# Altium project QUANTUM_PCI_v1.PrjPcb (part 3 of 3)

## Sheet 09-USBUart_PPSMUX_UARTMUX.SchDoc
size B; SPICEModelCacheLIOYUQKN: <root> / <DocumentId>LIOYUQKN</DocumentId> / <CacheFrame Number="0"> / <Model Name="emk105bj105_v-f" Kind="CKT"> / <Text>* EMK105BJ105_V-F     SPICE MODEL  ( General Type ) / *-------------------------------------------------------------------------------------------------------- / * Model Generated by TAIYO YUDEN Corporation (http://www.ty-top.com) / * Version 1.0 / * TAIYO YUDEN Control No. 170508_130520 / * Copyright(c) 2012 TAIYO YUDEN CO.,LTD. All Rights Reserved. / *-------------------------------------------------------------------------------------------------------- / * / * Products Name : Multilayer Ceramic Capacitors / * / * Characteristics : / *     Capacitance : 1 uF , Rated Voltage : 16V , TCC : X5R / *     Case Size : 1.0 x 0.5 / 0.039 x 0.02 [mm/inch] , Thickness : 0.5 / 0.02 [mm/inch] / *     (Conditions: Temperature = 25 degC , DC Bias Current/Voltage = 0A / 0V) / * / * Frequency Range : 40Hz - 3GHz / * / * External Node Assignments : / * / *  1  o---| |---o  2 / * / *-------------------------------------------------------------------------------------------------------- / .SubCkt EMK105BJ105_V-F 1 2 / **************************** / C0 1 110 0.68309u / Cm 1 101 0.26053u / C1 101 102 0.94076u / Rc1 101 102 1.9029k / C2 102 103 0.66707u / Rc2 102 103 120.36 / C3 103 110 0.57203u / Rc3 103 110 2.1097 / C2m 1 301 0.1871u / C21 301 302 3.2494u / Rc21 301 302 1.1117k / C22 302 303 2.1014u / Rc22 302 303 1.484k / C23 303 304 2.1172u / Rc23 303 304 1.3876k / C24 304 305 0.75729u / Rc24 304 305 332.59 / C25 305 306 0.94401u / Rc25 305 306 249.09 / C26 306 307 0.34674u / Rc26 306 307 28.352 / C27 307 308 0.37158u / Rc27 307 308 19.989 / C28 308 309 0.17933u / Rc28 308 309 31.748 / C29 309 110 0.016445u / Rc29 309 110 1.0592 / Rp0 1 110 100Meg / L0 110 120 0.2216n / Lm 120 130 0.1509n / L1 120 121 0.12659n / RL1 121 130 0.85161 / L2 120 122 0.15996n / RL2 122 130 0.42469 / L3 120 123 7.9543n / RL3 123 130 0.54643m / CR 120 124 0.24334u / LR 124 125 0.090738n / RR 125 130 68.076m / CL 130 140 2.7354p / LL 130 140 0.10762n / RL 130 140 50.614 / Rs 140 2 7.5416m / **************************** / .ends EMK105BJ105_V-F</Text> / </Model> / </CacheFrame> / </root>
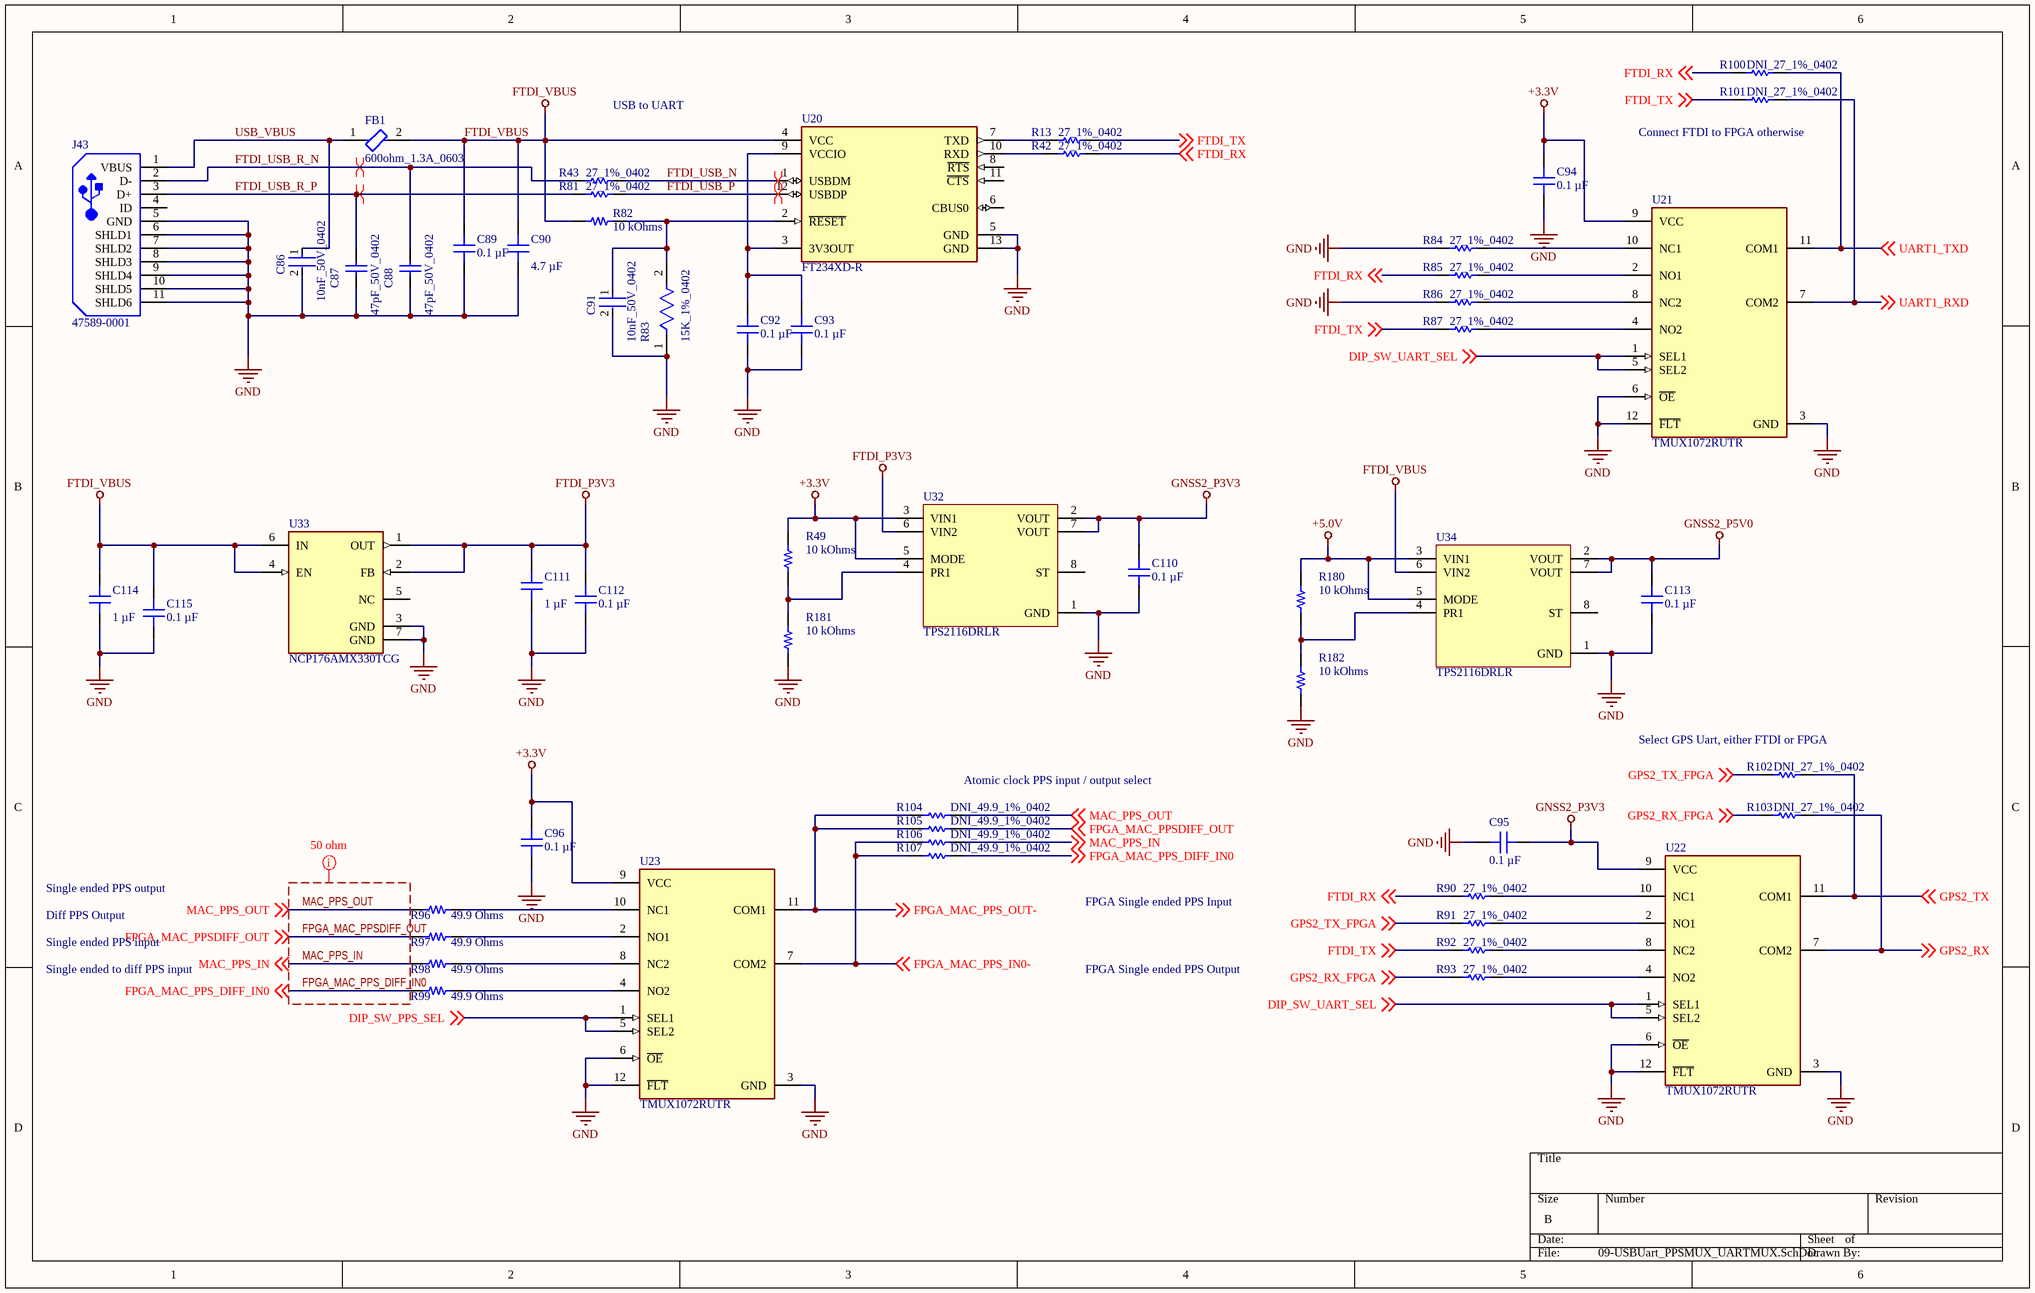
[diagram p7: 09-USBUart_PPSMUX_UARTMUX.SchDoc]

### Parts
C86  10nF_50V_0402  [FP-CC0402-MFG]
C87  47pF_50V_0402  [CAPC1005X55X25LL05T10]
C88  47pF_50V_0402  [CAPC1005X55X25LL05T10]
C89  0.1 µF  [CAP 0402_1005]
C90  4.7 µF  [MURATA CAP GRM31C 1206_3216]
C91  10nF_50V_0402  [FP-CC0402-MFG]
C92  0.1 µF  [CAP 0402_1005]
C93  0.1 µF  [CAP 0402_1005]
C94  0.1 µF  [CAP 0402_1005]
C95  0.1 µF  [CAP 0402_1005]
C96  0.1 µF  [CAP 0402_1005]
C110  0.1 µF  [CAP 0402_1005]
C111  1 µF  [CAP 0402_1005]
C112  0.1 µF  [CAP 0402_1005]
C113  0.1 µF  [CAP 0402_1005]
C114  1 µF  [CAP 0402_1005]
C115  0.1 µF  [CAP 0402_1005]
FB1  600ohm_1.3A_0603  [FP-BLM18-0_15-t0_8-IPC_A]
J43  47589-0001  [MOLX-47589-0001_V]
R13  27_1%_0402  [RESC1005X40X25NL05T05]
R42  27_1%_0402  [RESC1005X40X25NL05T05]
R43  27_1%_0402  [RESC1005X40X25NL05T05]
R49  10 kOhms  [YAGEO RES 0402_1005]
R81  27_1%_0402  [RESC1005X40X25NL05T05]
R82  10 kOhms  [YAGEO RES 0402_1005]
R83  15K_1%_0402  [FP-ERJ2R-MFG]
R84  27_1%_0402  [RESC1005X40X25NL05T05]
R85  27_1%_0402  [RESC1005X40X25NL05T05]
R86  27_1%_0402  [RESC1005X40X25NL05T05]
R87  27_1%_0402  [RESC1005X40X25NL05T05]
R90  27_1%_0402  [RESC1005X40X25NL05T05]
R91  27_1%_0402  [RESC1005X40X25NL05T05]
R92  27_1%_0402  [RESC1005X40X25NL05T05]
R93  27_1%_0402  [RESC1005X40X25NL05T05]
R96  49.9 Ohms  [YAGEO RES 0402_1005]
R97  49.9 Ohms  [YAGEO RES 0402_1005]
R98  49.9 Ohms  [YAGEO RES 0402_1005]
R99  49.9 Ohms  [YAGEO RES 0402_1005]
R100  DNI_27_1%_0402  [RESC1005X40X25NL05T05]  (no BOM)
R101  DNI_27_1%_0402  [RESC1005X40X25NL05T05]  (no BOM)
R102  DNI_27_1%_0402  [RESC1005X40X25NL05T05]  (no BOM)
R103  DNI_27_1%_0402  [RESC1005X40X25NL05T05]  (no BOM)
R104  DNI_49.9_1%_0402  [RESC1005X40X25LL05T10]  (no BOM)
R105  DNI_49.9_1%_0402  [RESC1005X40X25LL05T10]  (no BOM)
R106  DNI_49.9_1%_0402  [RESC1005X40X25LL05T10]  (no BOM)
R107  DNI_49.9_1%_0402  [RESC1005X40X25LL05T10]  (no BOM)
R180  10 kOhms  [YAGEO RES 0402_1005]
R181  10 kOhms  [YAGEO RES 0402_1005]
R182  10 kOhms  [YAGEO RES 0402_1005]
U20  FT234XD-R  [FP-DFN-12-IPC_B]
U21  TMUX1072RUTR  [FP-RUT0012A-MFG]
U22  TMUX1072RUTR  [FP-RUT0012A-MFG]
U23  TMUX1072RUTR  [FP-RUT0012A-MFG]
U32  TPS2116DRLR  [IC_TPS2116]
U33  NCP176AMX330TCG  [FP-711AT-MFG]
U34  TPS2116DRLR  [IC_TPS2116]

### Nets
+3.3V: C94.1 C96.1 R49.2 U21.9(VCC) U23.9(VCC) U32.3(VIN1) U32.5(MODE)
+5.0V: R180.2 U34.3(VIN1) U34.5(MODE)
FTDI_P3V3: C111.2 C112.1 U32.6(VIN2) U33.1(OUT) U33.2(FB)
FTDI_VBUS: C89.1 C90.2 C114.2 C115.1 FB1.2 R82.2 U20.4(VCC) U33.4(EN) U33.6(IN) U34.6(VIN2)
GND: C86.2 C87.1 C88.1 C89.2 C90.1 C91.2 C92.2 C93.2 C94.2 C95.2 C96.2 C110.2 C111.1 C112.2 C113.2 C114.1 C115.2 J43.5(GND) J43.6(SHLD1) J43.7(SHLD2) J43.8(SHLD3) J43.9(SHLD4) J43.10(SHLD5) J43.11(SHLD6) R83.1 R84.1 R86.1 R181.1 R182.1 U20.5(GND) U20.13(GND) U21.3(GND) U21.6(~{OE}) U21.12(~{FLT}) U22.3(GND) U22.6(~{OE}) U22.12(~{FLT}) U23.3(GND) U23.6(~{OE}) U23.12(~{FLT}) U32.1(GND) U33.3(GND) U33.7(GND) U34.1(GND)
GNSS2_P3V3: C95.1 C110.1 U22.9(VCC) U32.2(VOUT) U32.7(VOUT)
GNSS2_P5V0: C113.1 U34.2(VOUT) U34.7(VOUT)
DIP_SW_PPS_SEL: U23.1(SEL1) U23.5(SEL2) ; off-sheet DIP_SW_PPS_SEL
DIP_SW_UART_SEL: U21.1(SEL1) U21.5(SEL2) U22.1(SEL1) U22.5(SEL2) ; off-sheet DIP_SW_UART_SEL
FPGA_MAC_PPS_DIFF_IN0: R99.1 R107.2 ; off-sheet FPGA_MAC_PPS_DIFF_IN0
FPGA_MAC_PPS_IN0-: R106.1 R107.1 U23.7(COM2) ; off-sheet FPGA_MAC_PPS_IN0-
FPGA_MAC_PPS_OUT-: R104.1 R105.1 U23.11(COM1) ; off-sheet FPGA_MAC_PPS_OUT-
FPGA_MAC_PPSDIFF_OUT: R97.1 R105.2 ; off-sheet FPGA_MAC_PPSDIFF_OUT
FTDI_RX: R42.2 R85.1 R90.1 R100.1 ; off-sheet FTDI_RX
FTDI_TX: R13.2 R87.1 R92.1 R101.1 ; off-sheet FTDI_TX
FTDI_USB_N: R43.2 U20.1(USBDM)
FTDI_USB_P: R81.2 U20.12(USBDP)
FTDI_USB_R_N: C88.2 J43.2(D-) R43.1
FTDI_USB_R_P: C87.2 J43.3(D+) R81.1
GPS2_RX: R103.2 U22.7(COM2) ; off-sheet GPS2_RX
GPS2_RX_FPGA: R93.1 R103.1 ; off-sheet GPS2_RX_FPGA
GPS2_TX: R102.2 U22.11(COM1) ; off-sheet GPS2_TX
GPS2_TX_FPGA: R91.1 R102.1 ; off-sheet GPS2_TX_FPGA
MAC_PPS_IN: R98.1 R106.2 ; off-sheet MAC_PPS_IN
MAC_PPS_OUT: R96.1 R104.2 ; off-sheet MAC_PPS_OUT
UART1_RXD: R101.2 U21.7(COM2) ; off-sheet UART1_RXD
UART1_TXD: R100.2 U21.11(COM1) ; off-sheet UART1_TXD
USB_VBUS: C86.1 FB1.1 J43.1(VBUS)
NetC91_1: C91.1 R82.1 R83.2 U20.2(~{RESET})
NetC92_1: C92.1 C93.1 U20.3(3V3OUT) U20.9(VCCIO)
NetR13_1: R13.1 U20.7(TXD)
NetR42_1: R42.1 U20.10(RXD)
NetR49_1: R49.1 R181.2 U32.4(PR1)
NetR84_2: R84.2 U21.10(NC1)
NetR85_2: R85.2 U21.2(NO1)
NetR86_2: R86.2 U21.8(NC2)
NetR87_2: R87.2 U21.4(NO2)
NetR90_2: R90.2 U22.10(NC1)
NetR91_2: R91.2 U22.2(NO1)
NetR92_2: R92.2 U22.8(NC2)
NetR93_2: R93.2 U22.4(NO2)
NetR96_2: R96.2 U23.10(NC1)
NetR97_2: R97.2 U23.2(NO1)
NetR98_2: R98.2 U23.8(NC2)
NetR99_2: R99.2 U23.4(NO2)
NetR180_1: R180.1 R182.2 U34.4(PR1)

Not connected (* = marked no-connect by the designer): J43 4(ID); U20 6(CBUS0) 8(~{RTS}) 11(~{CTS}); U32 8(ST); U33 5(NC); U34 8(ST)

### Layout directives
differential pair: FTDI_USB_N, FTDI_USB_P, FTDI_USB_R_N, FTDI_USB_R_P
net class S50: FPGA_MAC_PPS_DIFF_IN0, FPGA_MAC_PPSDIFF_OUT, MAC_PPS_IN, MAC_PPS_OUT

### Notes on the sheet
- USB to UART
- (near R101) Connect FTDI to FPGA otherwise
- (near R102) Select GPS Uart, either FTDI or FPGA
- Atomic clock PPS input / output select
- Single ended PPS output
- FPGA Single ended PPS Input
- Diff PPS Output
- Single ended PPS input
- Single ended to diff PPS input
- FPGA Single ended PPS Output

### Library data of the parts
C86 C91 = CMP-2100-03592-2: CAP CER 10000PF 50V X7R 0402; Manufacturer Part Number: CC0402KRX7R9BB103; Manufacturer: YAGEO; Temperature Coefficient: 30ppm/°C; Capacitance: 10 nF; Material: Ceramic; Automotive Grade: NA; Tolerance: 0.1; Value: 10 nF; Device Class L3: Ceramic Capacitors; Temperature: -55°C to +125°C; Footprint Url: http://www.yageo.com/exep/pages/download/literatures/UPY-C_GEN_24.pdf; Ipc Land Pattern Name: CAPC10050X50; Device Class L1: Passive Components; Automotive: No; Octopart: https://octopart.com/cc0402krx7r9bb103-yageo-8376513; Lead Free: Yes; Temperature Range Low: -55°C; Height: 0.55mm; ComponentLink2URL: http://www.yageo.com/documents/recent/UPY-GP_NP0_16V-to-50V_16.pdf; Category: Cap; ComponentLink2Description: Datasheet; Temperature Range High: +125°C; Digikey Description: CAP CER 10000PF 50V X7R 0402; Voltage Rating: 50 V; Package: CC0402; Device Class L2: Capacitors; Mouser Description: 0402 10 nF 50 V ±10 % Tolerance X7R SMT Multilayer Ceramic Capacitor; RoHS: TRUE; Temperature Characteristic: X7R
C87 C88 = CMP-2008-04368-1: Part Number: GRM1555C1H470JA01D; Manufacturer: Murata
C89 C92-C96 C110 C112 C113 C115 = CC0402KRX7R9BB104: CAP CER 0.1UF 50V X7R 0402; manufacturer: Yageo; Tolerance: ±10%; Capacitance: 0.1 µF; series: CC; packaging: TapeAndReel; Part Number: CC0402KRX7R9BB104; Value: 0.1 µF; Applications: General Purpose; componentlink1description: Datasheet; componentlink1url: https://www.yageo.com/upload/media/product/productsearch/datasheet/mlcc/UPY-GPHC_X7R_6.3V-to-50V_18.pdf; componentlink2description: DigiKey Link; componentlink2url: https://www.digikey.com/en/products/detail/yageo/CC0402KRX7R9BB104/5883371; Device Package: 0402 (1005 Metric); lastupdated: 09.02.2024 20:04:27; Lifecycle Status: Active; Minimum Order: 10; Mounting Type: Surface Mount, MLCC; Operating Temperature: -55°C ~ 125°C; Package / Case: 0402 (1005 Metric); partid: 8451; Part Status: Active; price: 0.01; Size / Dimension: 0.039" L x 0.020" W (1.00mm x 0.50mm); Supplier 1: DigiKey; Supplier Part Number 1: 311-3566-1-ND; Temperature Coefficient: X7R; Thickness (Max): 0.022" (0.55mm); Voltage - Rated: 50V
C90 = GRM31CR71H475KA12L: CAP CER 4.7UF 50V X7R 1206; manufacturer: Murata Electronics; Tolerance: ±10%; Capacitance: 4.7 µF; packaging: TapeAndReel; Part Number: GRM31CR71H475KA12L; Value: 4.7 µF; Applications: General Purpose; componentlink1description: Datasheet; componentlink1url: https://www.murata.com/~/media/webrenewal/support/library/catalog/products/capacitor/mlcc/c02e.ashx?la=en-us; componentlink2description: DigiKey Link; componentlink2url: https://www.digikey.com/en/products/detail/murata-electronics/GRM31CR71H475KA12L/2548209; Device Package: 1206 (3216 Metric); lastupdated: 06.09.2024 2:27:23; Lifecycle Status: Active; Minimum Order: 1; Mounting Type: Surface Mount, MLCC; Operating Temperature: -55°C ~ 125°C; Package / Case: 1206 (3216 Metric); partid: 20010; Part Status: Active; price: 0.07; series: GRM; Size / Dimension: 0.126" L x 0.063" W (3.20mm x 1.60mm); Supplier 1: DigiKey; Supplier Part Number 1: 490-6521-1-ND; Temperature Coefficient: X7R; Thickness (Max): 0.071" (1.80mm); Voltage - Rated: 50V
C111 C114 = CC0402KRX5R8BB105: CAP CER 1UF 25V X5R 0402; manufacturer: Yageo; Tolerance: ±10%; packaging: TapeAndReel; series: CC; Capacitance: 1 µF; Part Number: CC0402KRX5R8BB105; Value: 1 µF; Applications: General Purpose; componentlink1description: Datasheet; componentlink1url: https://www.yageo.com/upload/media/product/productsearch/datasheet/mlcc/UPY-GPHC_X5R_4V-to-50V_25.pdf; componentlink2description: DigiKey Link; componentlink2url: https://www.digikey.com/en/products/detail/yageo/CC0402KRX5R8BB105/5195107; Device Package: 0402 (1005 Metric); lastupdated: 09.02.2024 20:04:25; Lifecycle Status: Active; Minimum Order: 1; Mounting Type: Surface Mount, MLCC; Operating Temperature: -55°C ~ 85°C; Package / Case: 0402 (1005 Metric); partid: 9641; Part Status: Active; price: 0.04; Size / Dimension: 0.039" L x 0.020" W (1.00mm x 0.50mm); Supplier 1: DigiKey; Supplier Part Number 1: 311-1698-1-ND; Temperature Coefficient: X5R; Thickness (Max): 0.022" (0.55mm); Voltage - Rated: 25V
FB1 = CMP-0686-00581-3: Chip Ferrite Bead, 0603, 600Ω @ 100MHz, 0.15Ω, 25%, 1.3A; Material: Steel; Number of Lines: 1; Impedance: 600R; DC Resistance (DCR): 150mR; Tolerance: 25%; Case Code (Metric): 1608; Width: 0.8mm; DC Current: 1.3A; Max DC Current: 1.3A; Package Quantity: 1; Number of Pins: 2; Military Standard: Not; RoHS Compliant: Yes; Termination: SMD/SMT; Max Operating Temperature: 125°C; Length: 1.6mm; Depth: 0.8mm; Case Code (Imperial): 0603; Series: BLM18K; Inductor Type: FERRITE BEAD; Core Material: Ferrite; Number of Circuits: 1; Height: 0.8mm; Case/Package: 0603; REACH SVHC: No SVHC; Packaging: Tape and Reel; Min Operating Temperature: -55°C; Max Current Rating: 1.3A; Radiation Hardening: No; Current Rating: 1.3A; Lead Free: Lead Free; Test Frequency: 100MHz; Weight: 7.1E-05oz
J43 = CMP-2000-05610-1: Right Angle Female Type AB Micro USB Connector, 30 V, 1.8 A, -30 to 85 degC, RoHS, Tape and Reel; Number of Ports: 1Port; Current Rating: 1.8A; Brand: Molex; Connector Type: MicroUSBTypeABreceptacle; Number of Contacts: 5Contact; Voltage Rating: 30VAC; Color: Black; Product: MicroUSBTypeABConnectors; Package URL: http://www.molex.com/pdm_docs/sd/475890001_sd.pdf; Contact Plating: Gold; Datasheet URL: http://www.molex.com/webdocs/datasheets/pdf/en-us/0475890001_IO_CONNECTORS.pdf; Operating Temperature Range: -20Cto+85C; Termination Style: SMD/SMT; Mounting Angle: Right; Package Reference: 47589-0001; Gender: Female; Package Description: Micro USB Connector, Pitch 0.65 mm, 5 Positions, Body 7.5 x 5.6 mm; Mounting Technology: SurfaceMount; Contact Material: CopperAlloy; Packaging: Reel; RoHS: True; Standard: USB; Manufacturer URL: http://www.molex.com/; Manufacturer: Molex; Datasheet Version: 12/2016; Product Category: USBConnectors; Series: 47589
R13 R42 R43 R81 R84-R87 R90-R93 R100-R103 = CMP-2002-08434-1: Part Number: CRCW040227R0FKED; Manufacturer: Vishay Dale
R49 R82 R180-R182 = RC0402FR-0710KL: RES 10K OHM 1% 1/16W 0402; Manufacturer: Yageo; Power (Watts): 0.063W, 1/16W; Temperature Coefficient: ±100ppm/°C; Part Number: RC0402FR-0710KL; Value: 10 kOhms; ComponentLink1Description: Datasheet; ComponentLink1URL: https://www.yageo.com/upload/media/product/productsearch/datasheet/rchip/PYu-RC_Group_51_RoHS_L_10.pdf; ComponentLink2Description: DigiKey Link; ComponentLink2URL: https://www.digikey.com/en/products/detail/yageo/RC0402FR-0710KL/726523; Composition: Thick Film; Device Package: 0402 (1005 Metric); Features: Moisture Resistant; Height - Seated (Max): 0.016" (0.40mm); LastUpdated: 25.07.2024 9:18:11; Lifecycle Status: Active; Minimum Order: 1; Number of Terminations: 2; Operating Temperature: -55°C ~ 155°C; Package / Case: 0402 (1005 Metric); Packaging: CutTape; PartId: 17593; Part Status: Active; Price: 0.01; Resistance: 10 kOhms; Series: RC_L; Size / Dimension: 0.039" L x 0.020" W (1.00mm x 0.50mm); Supplier 1: DigiKey; Supplier Part Number 1: 311-10.0KLRCT-ND; Supplier Device Package: 0402; Tolerance: ±1%
R83 = CMP-2002-00694-4: RES SMD 15K OHM 1% 1/10W 0402; Manufacturer Part Number: ERJ-2RKF1502X; Manufacturer: Panasonic; Automotive Grade: Grade 0; Voltage Rating: 50V; Resistance: 15kΩ; Temperature Coefficient: 100ppm/°C; Power Rating: 0.1W; Value: 15kΩ; ComponentLink2URL: https://industrial.panasonic.com/cdbs/www-data/pdf/RDA0000/AOA0000C304.pdf; Automotive: Yes; Temperature: -55°C to +155°C; Height: 0.4mm; Digikey Description: RES SMD 15K OHM 1% 1/10W 0402; Category: Res; Device Class L2: Resistors; Device Class L1: Passive Components; Package: ERJ2R; Temperature Range Low: -55°C; Tolerance: 1%; Series: ERJ; Footprint Url: https://b2b-api.panasonic.eu/file_stream/pids/fileversion/1180; Mouser Description: Res Thick Film 1.0 x 0.5 mm 15K Ohm 1% 0.1W(1/10W) 100ppm/ C Molded SMD Punched Carrier T/R; Composition: Thick Film; Lead Free: Yes; Device Class L3: Chip SMD Resistors; Octopart: https://octopart.com/erj-2rkf1502x-panasonic-55404985; RoHS: TRUE; Temperature Range High: +155°C; ComponentLink2Description: Datasheet
R96-R99 = RC0402FR-0749R9L: RES 49.9 OHM 1% 1/16W 0402; Manufacturer: Yageo; Power (Watts): 0.063W, 1/16W; Temperature Coefficient: ±100ppm/°C; Part Number: RC0402FR-0749R9L; Value: 49.9 Ohms; ComponentLink1Description: Datasheet; ComponentLink1URL: https://www.yageo.com/upload/media/product/productsearch/datasheet/rchip/PYu-RC_Group_51_RoHS_L_10.pdf; ComponentLink2Description: DigiKey Link; ComponentLink2URL: https://www.digikey.com/en/products/detail/yageo/RC0402FR-0749R9L/726621; Composition: Thick Film; Device Package: 0402 (1005 Metric); Features: Moisture Resistant; Height - Seated (Max): 0.016" (0.40mm); LastUpdated: 25.07.2024 9:18:11; Lifecycle Status: Active; Minimum Order: 1; Number of Terminations: 2; Operating Temperature: -55°C ~ 155°C; Package / Case: 0402 (1005 Metric); Packaging: CutTape; PartId: 17605; Part Status: Active; Price: 0.01; Resistance: 49.9 Ohms; Series: RC_L; Size / Dimension: 0.039" L x 0.020" W (1.00mm x 0.50mm); Supplier 1: DigiKey; Supplier Part Number 1: 311-49.9LRCT-ND; Supplier Device Package: 0402; Tolerance: ±1%
R104-R107 = CMP-2002-07709-1: Manufacturer: Yageo / Phycomp; Part Number: RC0402FR-0749R9L
U20 = CMP-0248-00027-3: IC USB SERIAL BASIC UART 12DFN; Min Supply Voltage: 2.97V; Number of Ports: 1; Operating Supply Voltage: 5V; Operating Supply Current: 8mA; Max Supply Voltage: 5.5V; Data Rate: 3Mbps; Length: 3mm; Case/Package: DFN; Mount: Surface Mount; Packaging: Tape and Reel; Max Operating Temperature: 85°C; Height: 0.75mm; Number of Pins: 12; Number of Transceivers: 1; Package Quantity: 5000; Min Operating Temperature: -40°C; Width: 3mm; REACH SVHC: No SVHC; Interface: UART; Lead Free: Lead Free
U21-U23 = CMP-04892-000114-1: IC SWITCH SPDT DUAL 12UQFN; Number of Circuits: 2; -3db Bandwidth: 1.2GHz; On-State Resistance: 18R; Number of Pins: 12; Min Operating Temperature: -40°C; RoHS Compliant: Yes; Max Operating Temperature: 125°C; Number of Channels: 2; Packaging: Tape and Reel
U32 U34 = IC_TPS2116DRLR: 1.6-V to 5.5-V, 40-mΩ, 2.5-A, low-IQ, priority power multiplexer 8-SOT-5X3 -40 to 125; MF: Texas Instruments; Check_prices: https://www.snapeda.com/parts/TPS2116DRLR/Texas%20Instruments/view-part/5674360/?ref=eda; MP: TPS2116DRLR; Package: Package; Price: None; Availability: No availability data; SnapEDA_Link: https://www.snapeda.com/parts/TPS2116DRLR/Texas%20Instruments/view-part/5674360/?ref=snap; Value: *; Supplier 1: LCSC; Manufacturer: Texas Instruments; Manufacturer Part Number: TPS2116DRLR; RoHS: Yes; Category: Voltage Supervisors; Stock 1: 562; Pricing 1: 1=0.6651, 10=0.5457, 30=0.4853, 100=0.4264, 500=0.3914, 1000=0.3723 (USD); Supplier Part Number 1: C3235557
U33 = CMP-07128-000022-1: IC REG LINEAR 3.3V 500MA 6XDFN; Manufacturer: ON Semiconductor; Output Type: Fixed; Dropout Voltage: 295mV; Number Of Outputs: 1; Standoff Height: 0mm; Min Supply Voltage: 1.4V; Nominal Supply Current: 60uA; Max Supply Voltage: 5.5V; Max Junction Temp: +150°C; Accuracy Percentage: 0.8%; Footprint Url: https://www.onsemi.com/pub/Collateral/711AT.PDF; Device Class L2: Power Management ICs; Device Class L1: Integrated Circuits (ICs); Digikey Description: IC REG LINEAR 3.3V 500MA 6XDFN; ComponentLink2Description: Datasheet; Output Voltage: 3.3V; ComponentLink2URL: https://www.onsemi.com/pub/Collateral/NCP176-D.PDF; RoHS: TRUE; Lead Free: Yes; Output Current: 500mA; Automotive: No; Temperature Range High: +150°C; Height: 0.45mm; Package: 711AT; Device Class L3: Voltage Regulators - Linear; Octopart: https://octopart.com/ncp176amx330tcg-on+semiconductor-61522616; Category: IC; Manufacturer Part Number: NCP176AMX330TCG; Ipc Land Pattern Name: DFN120X120X37-6; Temperature: to +150°C

## Sheet 10-M2_GPS.SchDoc
size B
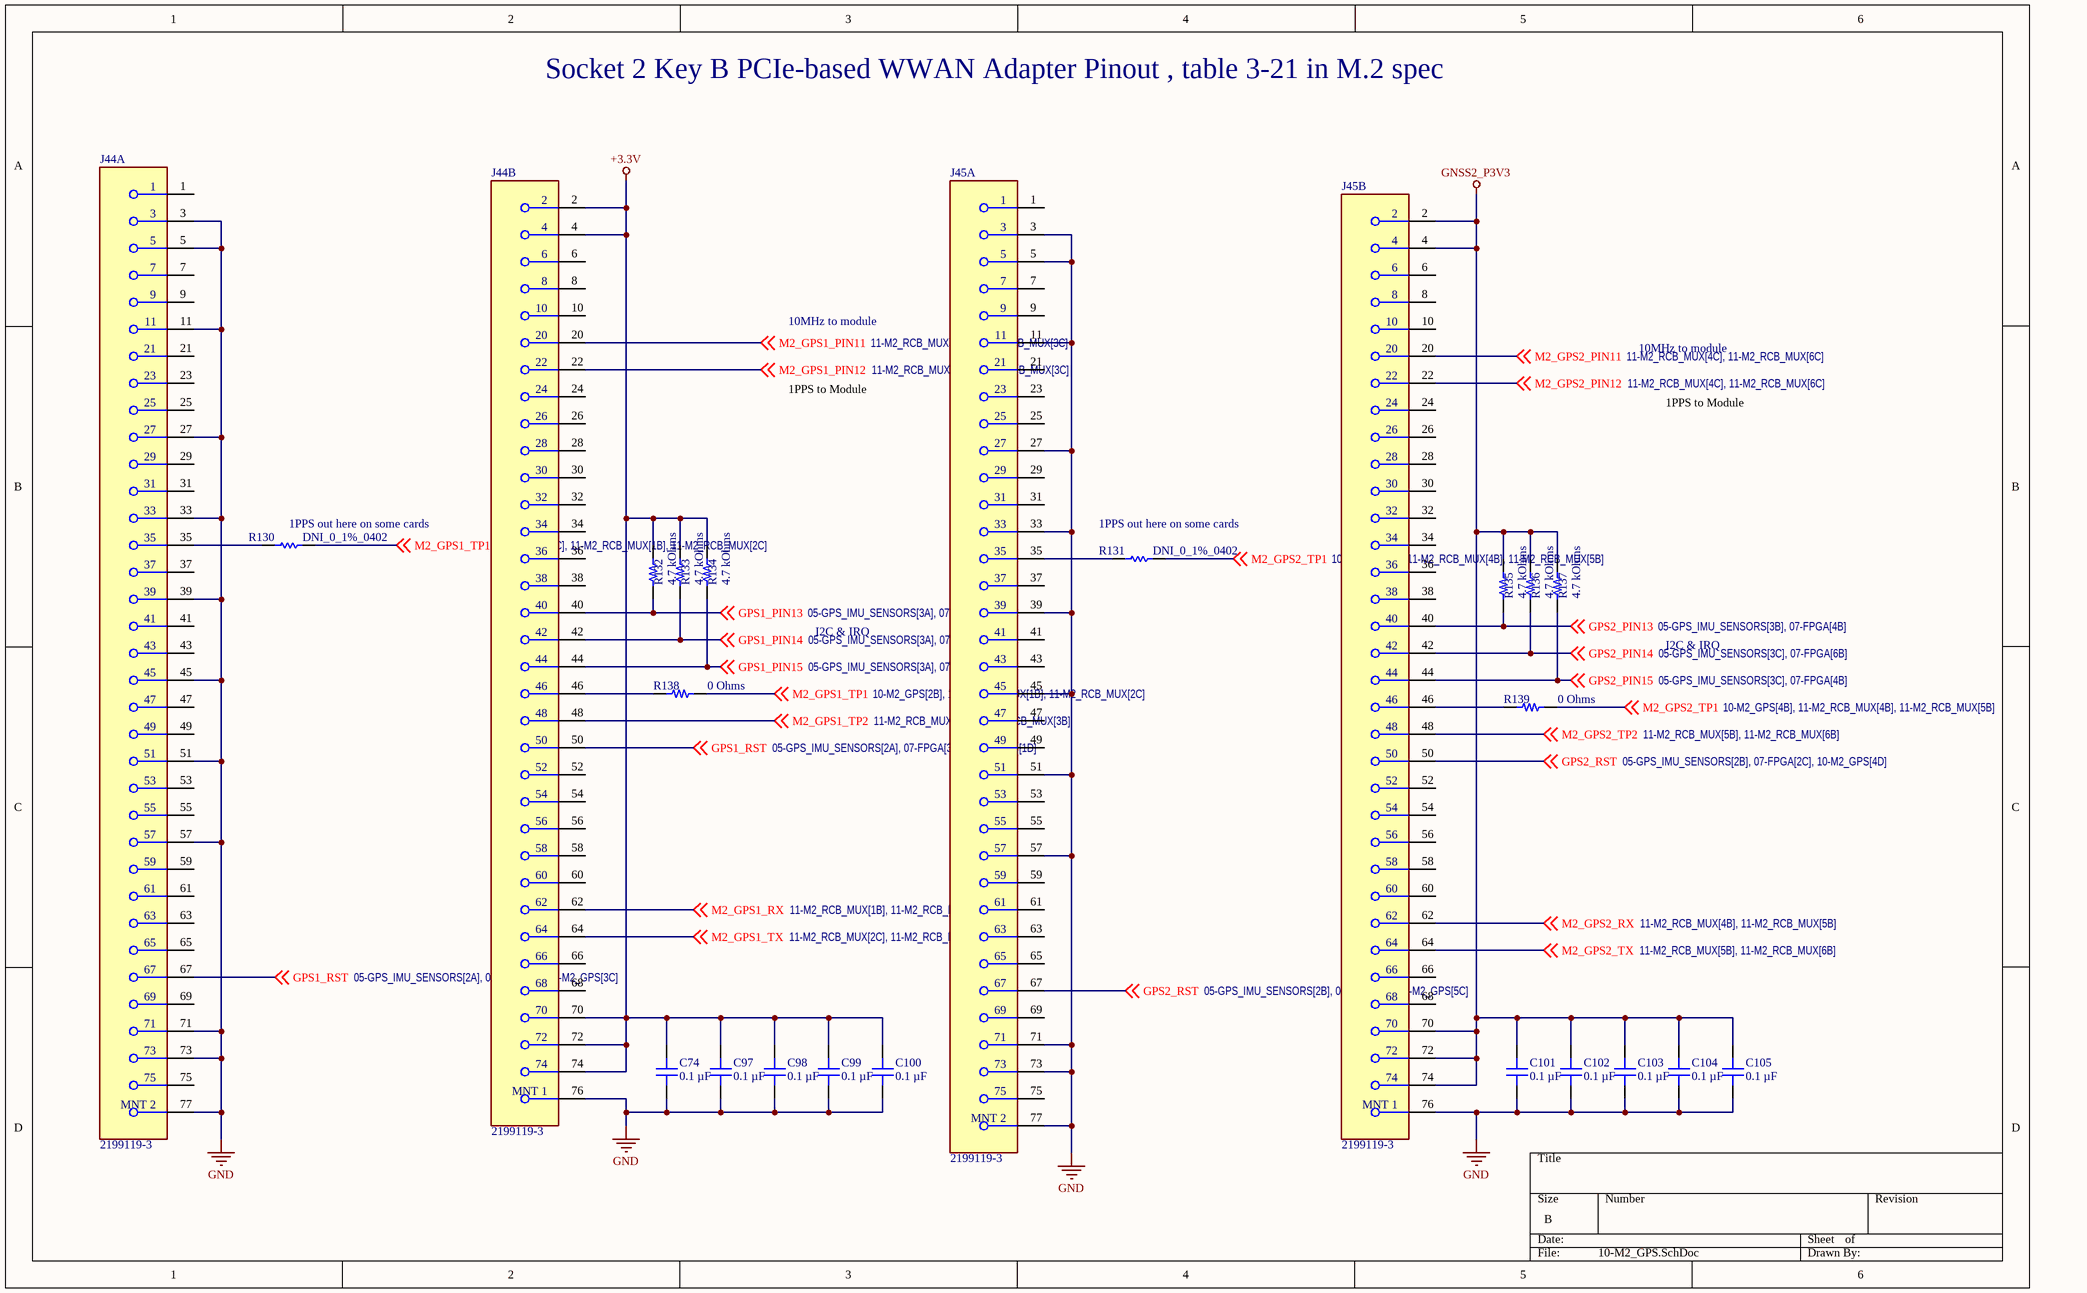
[diagram p8: 10-M2_GPS.SchDoc]

### Parts
C74  0.1 µF  [CAP 0402_1005]
C97  0.1 µF  [CAP 0402_1005]
C98  0.1 µF  [CAP 0402_1005]
C99  0.1 µF  [CAP 0402_1005]
C100  0.1 µF  [CAP 0402_1005]
C101  0.1 µF  [CAP 0402_1005]
C102  0.1 µF  [CAP 0402_1005]
C103  0.1 µF  [CAP 0402_1005]
C104  0.1 µF  [CAP 0402_1005]
C105  0.1 µF  [CAP 0402_1005]
J44  2199119-3  [FP-2199119-3-MFG]  (parts A,B of 2)
J45  2199119-3  [FP-2199119-3-MFG]  (parts A,B of 2)
R130  DNI_0_1%_0402  [RESC1005X40X25LL05T05]  (no BOM)
R131  DNI_0_1%_0402  [RESC1005X40X25LL05T05]  (no BOM)
R132  4.7 kOhms  [YAGEO RES 0402_1005]
R133  4.7 kOhms  [YAGEO RES 0402_1005]
R134  4.7 kOhms  [YAGEO RES 0402_1005]
R135  4.7 kOhms  [YAGEO RES 0402_1005]
R136  4.7 kOhms  [YAGEO RES 0402_1005]
R137  4.7 kOhms  [YAGEO RES 0402_1005]
R138  0 Ohms  [YAGEO RES 0402_1005]
R139  0 Ohms  [YAGEO RES 0402_1005]

### Nets
+3.3V: C74.1 C97.1 C98.1 C99.1 C100.1 J44.2 J44.4 J44.70 J44.72 J44.74 R132.2 R133.2 R134.2
GND: C74.2 C97.2 C98.2 C99.2 C100.2 C101.2 C102.2 C103.2 C104.2 C105.2 J44.3 J44.5 J44.11 J44.27 J44.33 J44.39 J44.45 J44.51 J44.57 J44.71 J44.73 J44.76(MNT_1) J44.77(MNT_2) J45.3 J45.5 J45.11 J45.27 J45.33 J45.39 J45.45 J45.51 J45.57 J45.71 J45.73 J45.76(MNT_1) J45.77(MNT_2)
GNSS2_P3V3: C101.1 C102.1 C103.1 C104.1 C105.1 J45.2 J45.4 J45.70 J45.72 J45.74 R135.2 R136.2 R137.2
GPS1_PIN13: J44.40 R132.1 ; off-sheet GPS1_PIN13
GPS1_PIN14: J44.42 R133.1 ; off-sheet GPS1_PIN14
GPS1_PIN15: J44.44 R134.1 ; off-sheet GPS1_PIN15
GPS1_RST: J44.50 J44.67 ; off-sheet GPS1_RST
GPS2_PIN13: J45.40 R135.1 ; off-sheet GPS2_PIN13
GPS2_PIN14: J45.42 R136.1 ; off-sheet GPS2_PIN14
GPS2_PIN15: J45.44 R137.1 ; off-sheet GPS2_PIN15
GPS2_RST: J45.50 J45.67 ; off-sheet GPS2_RST
M2_GPS1_PIN11: J44.20 ; off-sheet M2_GPS1_PIN11
M2_GPS1_PIN12: J44.22 ; off-sheet M2_GPS1_PIN12
M2_GPS1_RX: J44.62 ; off-sheet M2_GPS1_RX
M2_GPS1_TP1: R130.2 R138.2 ; off-sheet M2_GPS1_TP1
M2_GPS1_TP2: J44.48 ; off-sheet M2_GPS1_TP2
M2_GPS1_TX: J44.64 ; off-sheet M2_GPS1_TX
M2_GPS2_PIN11: J45.20 ; off-sheet M2_GPS2_PIN11
M2_GPS2_PIN12: J45.22 ; off-sheet M2_GPS2_PIN12
M2_GPS2_RX: J45.62 ; off-sheet M2_GPS2_RX
M2_GPS2_TP1: R131.2 R139.2 ; off-sheet M2_GPS2_TP1
M2_GPS2_TP2: J45.48 ; off-sheet M2_GPS2_TP2
M2_GPS2_TX: J45.64 ; off-sheet M2_GPS2_TX
NetJ44_35: J44.35 R130.1
NetJ44_46: J44.46 R138.1
NetJ45_35: J45.35 R131.1
NetJ45_46: J45.46 R139.1

Not connected (* = marked no-connect by the designer): J44 1 6 7 8 9 10 21 23 24 25 26 28 29 30 31 32 34 36 37 38 41 43 47 49 52 53 54 55 56 58 59 60 61 63 65 66 68 69 75; J45 1 6 7 8 9 10 21 23 24 25 26 28 29 30 31 32 34 36 37 38 41 43 47 49 52 53 54 55 56 58 59 60 61 63 65 66 68 69 75

### Notes on the sheet
- Socket 2 Key B PCIe-based WWAN Adapter Pinout , table 3-21 in M.2 spec
- 10MHz to module
- 1PPS to Module
- (near R130) 1PPS out here on some cards
- (near R131) 1PPS out here on some cards
- I2C & IRQ

### Library data of the parts
C74 C97-C105 = CC0402KRX7R9BB104: as C89 on sheet 09-USBUart_PPSMUX_UARTMUX; Capacitance: 0.1 µF; series: CC; packaging: TapeAndReel; Part Number: CC0402KRX7R9BB104; Value: 0.1 µF; Applications: General Purpose; componentlink1description: Datasheet; componentlink1url: https://www.yageo.com/upload/media/product/productsearch/datasheet/mlcc/UPY-GPHC_X7R_6.3V-to-50V_18.pdf; componentlink2description: DigiKey Link; componentlink2url: https://www.digikey.com/en/products/detail/yageo/CC0402KRX7R9BB104/5883371; Device Package: 0402 (1005 Metric); lastupdated: 09.02.2024 20:04:27; Lifecycle Status: Active; Minimum Order: 10; Mounting Type: Surface Mount, MLCC; Operating Temperature: -55°C ~ 125°C; Package / Case: 0402 (1005 Metric); partid: 8451; Part Status: Active; price: 0.01; Size / Dimension: 0.039" L x 0.020" W (1.00mm x 0.50mm); Supplier 1: DigiKey; Supplier Part Number 1: 311-3566-1-ND; Temperature Coefficient: X7R; Thickness (Max): 0.022" (0.55mm); Voltage - Rated: 50V
J44 J45 = CMP-03365-000004-1: CONN M.2 FEMALE 67POS 0.020 GOLD; Contact Current Rating: 500mA; Number of Contacts: 67; PCB Mounting Orientation: Right Angle; Pitch: 0.5mm; Voltage Rating: 50V; Insulation Resistance: 500MR; Row Spacing: 7.55mm; Orientation: Right Angle; Length: 0.862inch; Radiation Hardening: No; Mount: Surface Mount; Contact Plating: Gold; Contact Material: Copper Alloy; Width: 8.7mm; Number of Rows: 2; Color: Black; ELV: Compliant; Housing Color: Black; Number of Positions: 67; Housing Material: Thermoplastic; Gender: Female; Min Operating Temperature: -40°C; Max Operating Temperature: 80°C; RoHS Compliant: Yes; Package Quantity: 1200; Packaging: Tape and Reel; Height: 3.2mm; Termination: Solder; Insulation Material: Thermoplastic; Max Voltage Rating (AC): 50V; Current Rating: 500mA
R130 R131 = CMP-2000-07451-1: Chip Resistor, 0 Ohm, 0.1 W, -55 to 155 degC, 0402 (1005 Metric), RoHS, Tape and Reel; Manufacturer: Panasonic; Voltage Rating (DC): 50V; Temperature Coefficient: 600ppm/��C; Max Power Dissipation: 100mW; Resistance: 0mOhm; Tolerance: 5%; Number of Terminations: 2; Mount: SurfaceMount; Height: 0.35mm; Packaging: TapeandReel; Contact Plating: Tin; Manufacturer URL: http://www.panasonic.com/; Composition: ThickFilm; Max Operating Temperature: 155degC; REACH SVHC: NoSVHC; Case/Package: 0402; Package Reference: 402; Depth: 0.5mm; Package Description: 2-Pin Surface Mount Device, Body 1 x 0.5 mm; Datasheet URL: https://industrial.panasonic.com/cdbs/www-data/pdf/RDA0000/AOA0000C301.pdf; RoHSCompliant: True; Case Code (Imperial): 0402; Military Standard: Not; Min Operating Temperature: -55degC; Power Rating: 100mW; Datasheet Version: 03/2015; Length: 1mm; Case Code (Metric): 1005; Termination: SMD/SMT; Mounting Technology: SurfaceMount; Voltage Rating: 50V; Width: 0.02inch; Package Quantity: 1; Lead Free: LeadFree; Radiation Hardening: No
R132-R137 = RC0402FR-074K7L: RES 4.7K OHM 1% 1/16W 0402; Manufacturer: Yageo; Power (Watts): 0.063W, 1/16W; Temperature Coefficient: ±100ppm/°C; Part Number: RC0402FR-074K7L; Value: 4.7 kOhms; ComponentLink1Description: Datasheet; ComponentLink1URL: https://www.yageo.com/upload/media/product/productsearch/datasheet/rchip/PYu-RC_Group_51_RoHS_L_10.pdf; ComponentLink2Description: DigiKey Link; ComponentLink2URL: https://www.digikey.com/en/products/detail/yageo/RC0402FR-074K7L/2827563; Composition: Thick Film; Device Package: 0402 (1005 Metric); Features: Moisture Resistant; Height - Seated (Max): 0.016" (0.40mm); LastUpdated: 25.07.2024 9:18:11; Lifecycle Status: Active; Minimum Order: 1; Number of Terminations: 2; Operating Temperature: -55°C ~ 155°C; Package / Case: 0402 (1005 Metric); Packaging: CutTape; PartId: 17603; Part Status: Active; Price: 0.01; Resistance: 4.7 kOhms; Series: RC_L; Size / Dimension: 0.039" L x 0.020" W (1.00mm x 0.50mm); Supplier 1: DigiKey; Supplier Part Number 1: 311-4.7KLRCT-ND; Supplier Device Package: 0402; Tolerance: ±1%
R138 R139 = RC0402FR-070RL: RES 0 OHM JUMPER 1/16W 0402; Manufacturer: Yageo; Power (Watts): 0.063W, 1/16W; Number of Terminations: 2; Packaging: CutTape; Composition: Thick Film; Resistance: 0 Ohms; Tolerance: Jumper; Part Number: RC0402FR-070RL; Value: 0 Ohms; ComponentLink1Description: Datasheet; ComponentLink1URL: https://www.yageo.com/upload/media/product/productsearch/datasheet/rchip/PYu-RC_Group_51_RoHS_L_10.pdf; ComponentLink2Description: DigiKey Link; ComponentLink2URL: https://www.digikey.com/en/products/detail/yageo/RC0402FR-070RL/2827570; Device Package: 0402 (1005 Metric); Features: Moisture Resistant; Height - Seated (Max): 0.016" (0.40mm); LastUpdated: 25.07.2024 9:18:11; Lifecycle Status: Active; Minimum Order: 1; Operating Temperature: -55°C ~ 155°C; Package / Case: 0402 (1005 Metric); PartId: 17630; Part Status: Active; Price: 0.01; Series: RC_L; Size / Dimension: 0.039" L x 0.020" W (1.00mm x 0.50mm); Supplier 1: DigiKey; Supplier Part Number 1: 311-0.0LRCT-ND; Supplier Device Package: 0402

## Sheet 11-M2_RCB_MUX.SchDoc
size B
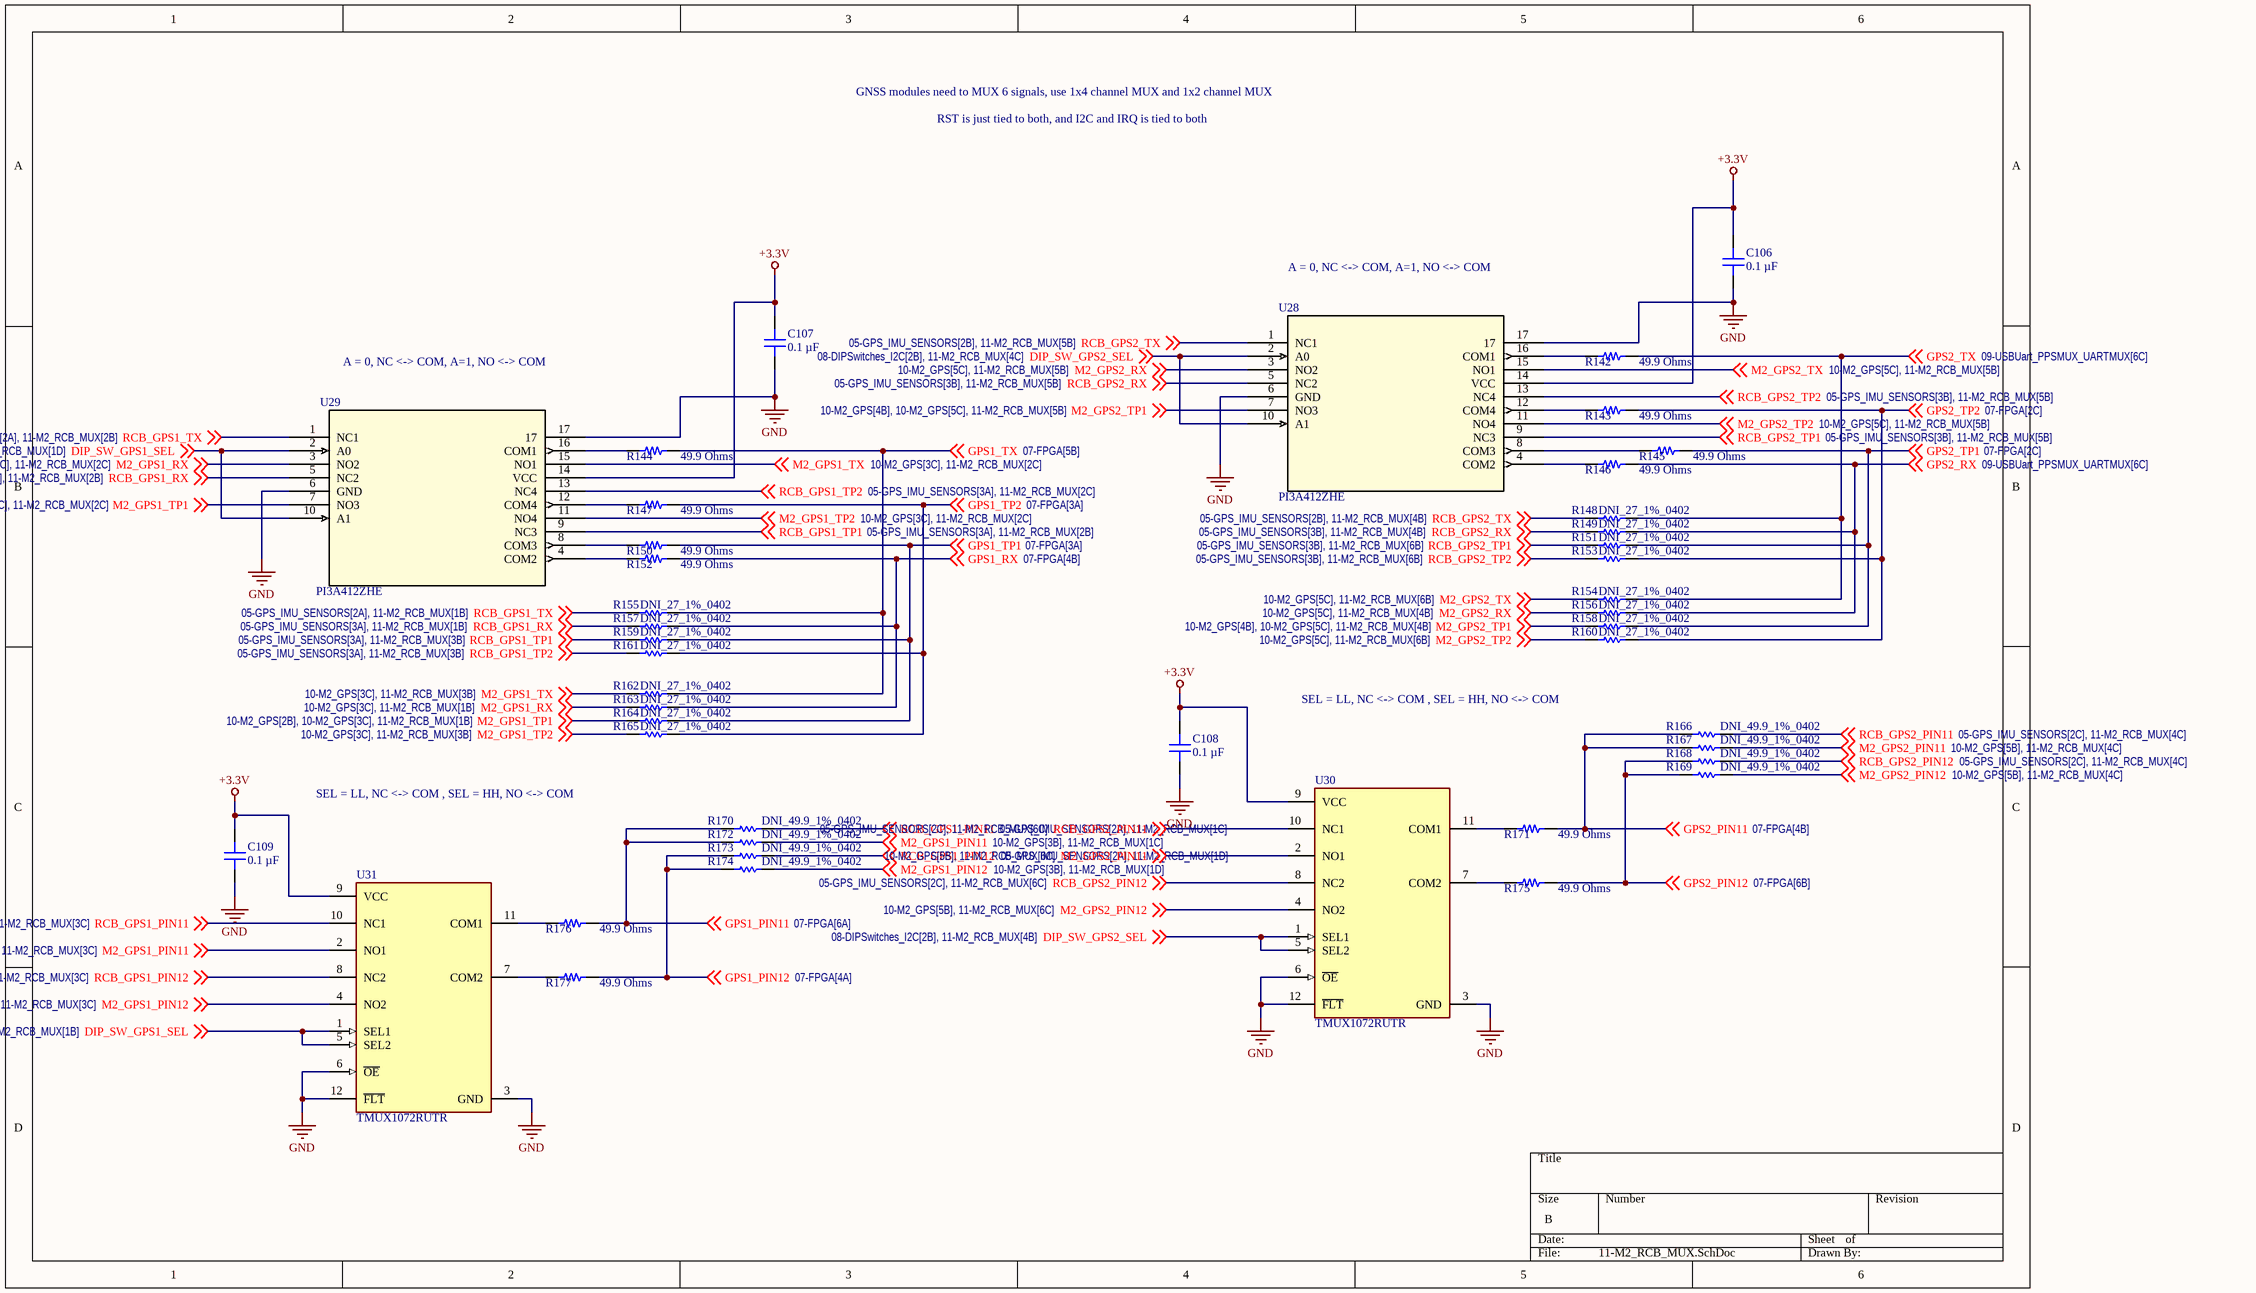
[diagram p9: 11-M2_RCB_MUX.SchDoc]

### Parts
C106  0.1 µF  [CAP 0402_1005]
C107  0.1 µF  [CAP 0402_1005]
C108  0.1 µF  [CAP 0402_1005]
C109  0.1 µF  [CAP 0402_1005]
R142  49.9 Ohms  [YAGEO RES 0402_1005]
R143  49.9 Ohms  [YAGEO RES 0402_1005]
R144  49.9 Ohms  [YAGEO RES 0402_1005]
R145  49.9 Ohms  [YAGEO RES 0402_1005]
R146  49.9 Ohms  [YAGEO RES 0402_1005]
R147  49.9 Ohms  [YAGEO RES 0402_1005]
R148  DNI_27_1%_0402  [RESC1005X40X25NL05T05]  (no BOM)
R149  DNI_27_1%_0402  [RESC1005X40X25NL05T05]  (no BOM)
R150  49.9 Ohms  [YAGEO RES 0402_1005]
R151  DNI_27_1%_0402  [RESC1005X40X25NL05T05]  (no BOM)
R152  49.9 Ohms  [YAGEO RES 0402_1005]
R153  DNI_27_1%_0402  [RESC1005X40X25NL05T05]  (no BOM)
R154  DNI_27_1%_0402  [RESC1005X40X25NL05T05]  (no BOM)
R155  DNI_27_1%_0402  [RESC1005X40X25NL05T05]  (no BOM)
R156  DNI_27_1%_0402  [RESC1005X40X25NL05T05]  (no BOM)
R157  DNI_27_1%_0402  [RESC1005X40X25NL05T05]  (no BOM)
R158  DNI_27_1%_0402  [RESC1005X40X25NL05T05]  (no BOM)
R159  DNI_27_1%_0402  [RESC1005X40X25NL05T05]  (no BOM)
R160  DNI_27_1%_0402  [RESC1005X40X25NL05T05]  (no BOM)
R161  DNI_27_1%_0402  [RESC1005X40X25NL05T05]  (no BOM)
R162  DNI_27_1%_0402  [RESC1005X40X25NL05T05]  (no BOM)
R163  DNI_27_1%_0402  [RESC1005X40X25NL05T05]  (no BOM)
R164  DNI_27_1%_0402  [RESC1005X40X25NL05T05]  (no BOM)
R165  DNI_27_1%_0402  [RESC1005X40X25NL05T05]  (no BOM)
R166  DNI_49.9_1%_0402  [RESC1005X40X25LL05T10]  (no BOM)
R167  DNI_49.9_1%_0402  [RESC1005X40X25LL05T10]  (no BOM)
R168  DNI_49.9_1%_0402  [RESC1005X40X25LL05T10]  (no BOM)
R169  DNI_49.9_1%_0402  [RESC1005X40X25LL05T10]  (no BOM)
R170  DNI_49.9_1%_0402  [RESC1005X40X25LL05T10]  (no BOM)
R171  49.9 Ohms  [YAGEO RES 0402_1005]
R172  DNI_49.9_1%_0402  [RESC1005X40X25LL05T10]  (no BOM)
R173  DNI_49.9_1%_0402  [RESC1005X40X25LL05T10]  (no BOM)
R174  DNI_49.9_1%_0402  [RESC1005X40X25LL05T10]  (no BOM)
R175  49.9 Ohms  [YAGEO RES 0402_1005]
R176  49.9 Ohms  [YAGEO RES 0402_1005]
R177  49.9 Ohms  [YAGEO RES 0402_1005]
U28  PI3A412ZHE  [ZH16_PER]
U29  PI3A412ZHE  [ZH16_PER]
U30  TMUX1072RUTR  [FP-RUT0012A-MFG]
U31  TMUX1072RUTR  [FP-RUT0012A-MFG]

### Nets
+3.3V: C106.2 C107.2 C108.1 C109.1 U28.14(VCC) U29.14(VCC) U30.9(VCC) U31.9(VCC)
GND: C106.1 C107.1 C108.2 C109.2 U28.6(GND) U28.17 U29.6(GND) U29.17 U30.3(GND) U30.6(~{OE}) U30.12(~{FLT}) U31.3(GND) U31.6(~{OE}) U31.12(~{FLT})
DIP_SW_GPS1_SEL: U29.2(A0) U29.10(A1) U31.1(SEL1) U31.5(SEL2) ; off-sheet DIP_SW_GPS1_SEL
DIP_SW_GPS2_SEL: U28.2(A0) U28.10(A1) U30.1(SEL1) U30.5(SEL2) ; off-sheet DIP_SW_GPS2_SEL
GPS1_PIN11: R170.1 R172.1 R176.2 ; off-sheet GPS1_PIN11
GPS1_PIN12: R173.1 R174.1 R177.2 ; off-sheet GPS1_PIN12
GPS1_RX: R152.2 R157.2 R163.2 ; off-sheet GPS1_RX
GPS1_TP1: R150.2 R159.2 R164.2 ; off-sheet GPS1_TP1
GPS1_TP2: R147.2 R161.2 R165.2 ; off-sheet GPS1_TP2
GPS1_TX: R144.2 R155.2 R162.2 ; off-sheet GPS1_TX
GPS2_PIN11: R166.1 R167.1 R171.2 ; off-sheet GPS2_PIN11
GPS2_PIN12: R168.1 R169.1 R175.2 ; off-sheet GPS2_PIN12
GPS2_RX: R146.2 R149.2 R156.2 ; off-sheet GPS2_RX
GPS2_TP1: R145.2 R151.2 R158.2 ; off-sheet GPS2_TP1
GPS2_TP2: R143.2 R153.2 R160.2 ; off-sheet GPS2_TP2
GPS2_TX: R142.2 R148.2 R154.2 ; off-sheet GPS2_TX
M2_GPS1_PIN11: R172.2 U31.2(NO1) ; off-sheet M2_GPS1_PIN11
M2_GPS1_PIN12: R174.2 U31.4(NO2) ; off-sheet M2_GPS1_PIN12
M2_GPS1_RX: R163.1 U29.3(NO2) ; off-sheet M2_GPS1_RX
M2_GPS1_TP1: R164.1 U29.7(NO3) ; off-sheet M2_GPS1_TP1
M2_GPS1_TP2: R165.1 U29.11(NO4) ; off-sheet M2_GPS1_TP2
M2_GPS1_TX: R162.1 U29.15(NO1) ; off-sheet M2_GPS1_TX
M2_GPS2_PIN11: R167.2 U30.2(NO1) ; off-sheet M2_GPS2_PIN11
M2_GPS2_PIN12: R169.2 U30.4(NO2) ; off-sheet M2_GPS2_PIN12
M2_GPS2_RX: R156.1 U28.3(NO2) ; off-sheet M2_GPS2_RX
M2_GPS2_TP1: R158.1 U28.7(NO3) ; off-sheet M2_GPS2_TP1
M2_GPS2_TP2: R160.1 U28.11(NO4) ; off-sheet M2_GPS2_TP2
M2_GPS2_TX: R154.1 U28.15(NO1) ; off-sheet M2_GPS2_TX
RCB_GPS1_PIN11: R170.2 U31.10(NC1) ; off-sheet RCB_GPS1_PIN11
RCB_GPS1_PIN12: R173.2 U31.8(NC2) ; off-sheet RCB_GPS1_PIN12
RCB_GPS1_RX: R157.1 U29.5(NC2) ; off-sheet RCB_GPS1_RX
RCB_GPS1_TP1: R159.1 U29.9(NC3) ; off-sheet RCB_GPS1_TP1
RCB_GPS1_TP2: R161.1 U29.13(NC4) ; off-sheet RCB_GPS1_TP2
RCB_GPS1_TX: R155.1 U29.1(NC1) ; off-sheet RCB_GPS1_TX
RCB_GPS2_PIN11: R166.2 U30.10(NC1) ; off-sheet RCB_GPS2_PIN11
RCB_GPS2_PIN12: R168.2 U30.8(NC2) ; off-sheet RCB_GPS2_PIN12
RCB_GPS2_RX: R149.1 U28.5(NC2) ; off-sheet RCB_GPS2_RX
RCB_GPS2_TP1: R151.1 U28.9(NC3) ; off-sheet RCB_GPS2_TP1
RCB_GPS2_TP2: R153.1 U28.13(NC4) ; off-sheet RCB_GPS2_TP2
RCB_GPS2_TX: R148.1 U28.1(NC1) ; off-sheet RCB_GPS2_TX
NetR142_1: R142.1 U28.16(COM1)
NetR143_1: R143.1 U28.12(COM4)
NetR144_1: R144.1 U29.16(COM1)
NetR145_1: R145.1 U28.8(COM3)
NetR146_1: R146.1 U28.4(COM2)
NetR147_1: R147.1 U29.12(COM4)
NetR150_1: R150.1 U29.8(COM3)
NetR152_1: R152.1 U29.4(COM2)
NetR171_1: R171.1 U30.11(COM1)
NetR175_1: R175.1 U30.7(COM2)
NetR176_1: R176.1 U31.11(COM1)
NetR177_1: R177.1 U31.7(COM2)

### Notes on the sheet
- GNSS modules need to MUX 6 signals, use 1x4 channel MUX and 1x2 channel MUX
- RST is just tied to both, and I2C and IRQ is tied to both
- A = 0, NC <-> COM, A=1, NO <-> COM
- SEL = LL, NC <-> COM , SEL = HH, NO <-> COM

### Library data of the parts
C106-C109 = CC0402KRX7R9BB104: as C89 on sheet 09-USBUart_PPSMUX_UARTMUX; Capacitance: 0.1 µF; series: CC; packaging: TapeAndReel; Part Number: CC0402KRX7R9BB104; Value: 0.1 µF; Applications: General Purpose; componentlink1description: Datasheet; componentlink1url: https://www.yageo.com/upload/media/product/productsearch/datasheet/mlcc/UPY-GPHC_X7R_6.3V-to-50V_18.pdf; componentlink2description: DigiKey Link; componentlink2url: https://www.digikey.com/en/products/detail/yageo/CC0402KRX7R9BB104/5883371; Device Package: 0402 (1005 Metric); lastupdated: 09.02.2024 20:04:27; Lifecycle Status: Active; Minimum Order: 10; Mounting Type: Surface Mount, MLCC; Operating Temperature: -55°C ~ 125°C; Package / Case: 0402 (1005 Metric); partid: 8451; Part Status: Active; price: 0.01; Size / Dimension: 0.039" L x 0.020" W (1.00mm x 0.50mm); Supplier 1: DigiKey; Supplier Part Number 1: 311-3566-1-ND; Temperature Coefficient: X7R; Thickness (Max): 0.022" (0.55mm); Voltage - Rated: 50V
R142-R147 R150 R152 R171 R175-R177 = RC0402FR-0749R9L: as R96-R99 on sheet 09-USBUart_PPSMUX_UARTMUX; Part Number: RC0402FR-0749R9L; Value: 49.9 Ohms; ComponentLink1Description: Datasheet; ComponentLink1URL: https://www.yageo.com/upload/media/product/productsearch/datasheet/rchip/PYu-RC_Group_51_RoHS_L_10.pdf; ComponentLink2Description: DigiKey Link; ComponentLink2URL: https://www.digikey.com/en/products/detail/yageo/RC0402FR-0749R9L/726621; Composition: Thick Film; Device Package: 0402 (1005 Metric); Features: Moisture Resistant; Height - Seated (Max): 0.016" (0.40mm); LastUpdated: 25.07.2024 9:18:11; Lifecycle Status: Active; Minimum Order: 1; Number of Terminations: 2; Operating Temperature: -55°C ~ 155°C; Package / Case: 0402 (1005 Metric); Packaging: CutTape; PartId: 17605; Part Status: Active; Price: 0.01; Resistance: 49.9 Ohms; Series: RC_L; Size / Dimension: 0.039" L x 0.020" W (1.00mm x 0.50mm); Supplier 1: DigiKey; Supplier Part Number 1: 311-49.9LRCT-ND; Supplier Device Package: 0402; Tolerance: ±1%
R148 R149 R151 R153-R165 = CMP-2002-08434-1: as R13 on sheet 09-USBUart_PPSMUX_UARTMUX
R166-R170 R172-R174 = CMP-2002-07709-1: as R104 on sheet 09-USBUart_PPSMUX_UARTMUX
U28 U29 = PI3A412ZHE: No Description Available; Mfr_Name: Pericom; RefDes: RefDes; Type: Type
U30 U31 = CMP-04892-000114-1: as U21-U23 on sheet 09-USBUart_PPSMUX_UARTMUX; Number of Pins: 12; Min Operating Temperature: -40°C; RoHS Compliant: Yes; Max Operating Temperature: 125°C; Number of Channels: 2; Packaging: Tape and Reel

## Nets that join several sheets
+3.3V: 01-USER_IO (18 pins), 03-POWER (21 pins), 04-PCIe_JTAG (7 pins), 05-GPS_IMU_SENSORS (18 pins), 08-DIPSwitches_I2C (24 pins), 09-USBUart_PPSMUX_UARTMUX (7 pins), 10-M2_GPS (13 pins), 11-M2_RCB_MUX (8 pins)
+5.0V: 03-POWER (10 pins), 05-GPS_IMU_SENSORS (11 pins), 07-FPGA (8 pins), 09-USBUart_PPSMUX_UARTMUX (R180.2 U34.3 U34.5)
+12V_PCIE: 03-POWER (CR1.3 R44.1), 04-PCIe_JTAG (5 pins)
GND: 01-USER_IO (34 pins), 03-POWER (92 pins), 04-PCIe_JTAG (27 pins), 05-GPS_IMU_SENSORS (50 pins), 07-FPGA (56 pins), 08-DIPSwitches_I2C (15 pins), 09-USBUart_PPSMUX_UARTMUX (44 pins), 10-M2_GPS (36 pins), 11-M2_RCB_MUX (14 pins)
GNSS2_P3V3: 05-GPS_IMU_SENSORS (7 pins), 09-USBUart_PPSMUX_UARTMUX (5 pins), 10-M2_GPS (13 pins)
GNSS2_P5V0: 05-GPS_IMU_SENSORS (7 pins), 09-USBUart_PPSMUX_UARTMUX (C113.1 U34.2 U34.7)
ANADC_I2C_SCL: 05-GPS_IMU_SENSORS (P1.3), 08-DIPSwitches_I2C (R116.1 U27.8)
ANADC_I2C_SDA: 05-GPS_IMU_SENSORS (P1.4), 08-DIPSwitches_I2C (R115.1 U27.7)
ANT1_IN: 01-USER_IO (U8.3), 07-FPGA (J35.21)
ANT1_IO_IN: 01-USER_IO (R15.2 U8.7), 07-FPGA (J36.33)
ANT1_IO_OUT: 01-USER_IO (R14.2 U8.1), 07-FPGA (J36.31)
ANT1_OUT: 01-USER_IO (U8.2), 07-FPGA (J35.15)
ANT2_IN: 01-USER_IO (U12.3), 07-FPGA (J35.23)
ANT2_IO_IN: 01-USER_IO (R30.2 U12.7), 07-FPGA (J36.37)
ANT2_IO_OUT: 01-USER_IO (R29.2 U12.1), 07-FPGA (J36.35)
ANT2_OUT: 01-USER_IO (U12.2), 07-FPGA (J35.17)
ANT3_IN: 01-USER_IO (U11.3), 07-FPGA (J35.16)
ANT3_IO_IN: 01-USER_IO (R16.2 U11.7), 07-FPGA (J36.43)
ANT3_IO_OUT: 01-USER_IO (R17.2 U11.1), 07-FPGA (J36.41)
ANT3_OUT: 01-USER_IO (U11.2), 07-FPGA (J35.25)
ANT4_IN: 01-USER_IO (U16.3), 07-FPGA (J35.18)
ANT4_IO_IN: 01-USER_IO (R32.2 U16.7), 07-FPGA (J36.47)
ANT4_IO_OUT: 01-USER_IO (R31.2 U16.1), 07-FPGA (J36.45)
ANT4_OUT: 01-USER_IO (U16.2), 07-FPGA (J35.27)
BNO_INT: 05-GPS_IMU_SENSORS (R50.2 U13.14), 07-FPGA (J35.63)
DC_I2C_SCL: 03-POWER (R188.2), 05-GPS_IMU_SENSORS (P5.3), 08-DIPSwitches_I2C (R114.1 U27.10)
DC_I2C_SDA: 03-POWER (R187.2), 05-GPS_IMU_SENSORS (P5.4), 08-DIPSwitches_I2C (R113.1 U27.9)
DIP_SW_GPS1_SEL: 08-DIPSwitches_I2C (R141.2 R179.2 SW1.6), 11-M2_RCB_MUX (U29.2 U29.10 U31.1 U31.5)
DIP_SW_GPS2_SEL: 08-DIPSwitches_I2C (R140.2 R178.2 SW1.7), 11-M2_RCB_MUX (U28.2 U28.10 U30.1 U30.5)
DIP_SW_PPS_SEL: 08-DIPSwitches_I2C (R88.2 R122.2 SW1.9), 09-USBUart_PPSMUX_UARTMUX (U23.1 U23.5)
DIP_SW_UART_SEL: 08-DIPSwitches_I2C (R78.2 R112.2 SW1.10), 09-USBUart_PPSMUX_UARTMUX (U21.1 U21.5 U22.1 U22.5)
EXT_EEPROM_WP: 05-GPS_IMU_SENSORS (R37.1 U7.5), 07-FPGA (J34.44)
FPGA_BNO_XIN32: 05-GPS_IMU_SENSORS (R71.2), 07-FPGA (J35.36)
FPGA_BNO_XOUT32: 05-GPS_IMU_SENSORS (R73.2), 07-FPGA (J35.38)
FPGA_MAC_PPS_IN0-: 07-FPGA (J35.47), 09-USBUart_PPSMUX_UARTMUX (R106.1 R107.1 U23.7)
FPGA_MAC_PPS_OUT-: 07-FPGA (J35.43), 09-USBUart_PPSMUX_UARTMUX (R104.1 R105.1 U23.11)
FPGA_MAC_UART_TX: 07-FPGA (J35.26), 08-DIPSwitches_I2C (R74.1 R94.1)
FPGA_TCK: 04-PCIe_JTAG (D5.3 R18.1), 07-FPGA (J36.77)
FPGA_TDI: 04-PCIe_JTAG (D8.3 R21.1), 07-FPGA (J36.78)
FPGA_TDO: 04-PCIe_JTAG (D6.3 R19.1), 07-FPGA (J36.79)
FPGA_TMS: 04-PCIe_JTAG (D7.3 R20.1), 07-FPGA (J36.80)
GPS1_PIN11: 07-FPGA (J35.4), 11-M2_RCB_MUX (R170.1 R172.1 R176.2)
GPS1_PIN12: 07-FPGA (J35.5), 11-M2_RCB_MUX (R173.1 R174.1 R177.2)
GPS1_PIN13: 05-GPS_IMU_SENSORS (J6.13), 07-FPGA (J35.2), 10-M2_GPS (J44.40 R132.1)
GPS1_PIN14: 05-GPS_IMU_SENSORS (J6.14), 07-FPGA (J35.3), 10-M2_GPS (J44.42 R133.1)
GPS1_PIN15: 05-GPS_IMU_SENSORS (J6.15), 07-FPGA (J35.1), 10-M2_GPS (J44.44 R134.1)
GPS1_RST: 05-GPS_IMU_SENSORS (J6.4 U9.4), 07-FPGA (J34.22), 10-M2_GPS (J44.50 J44.67)
GPS1_RX: 07-FPGA (J35.79), 11-M2_RCB_MUX (R152.2 R157.2 R163.2)
GPS1_TP1: 07-FPGA (J34.32), 11-M2_RCB_MUX (R150.2 R159.2 R164.2)
GPS1_TP2: 07-FPGA (J34.34), 11-M2_RCB_MUX (R147.2 R161.2 R165.2)
GPS1_TX: 07-FPGA (J35.80), 11-M2_RCB_MUX (R144.2 R155.2 R162.2)
GPS2_PIN11: 07-FPGA (J35.75), 11-M2_RCB_MUX (R166.1 R167.1 R171.2)
GPS2_PIN12: 07-FPGA (J35.76), 11-M2_RCB_MUX (R168.1 R169.1 R175.2)
GPS2_PIN13: 05-GPS_IMU_SENSORS (J13.13), 07-FPGA (J35.73), 10-M2_GPS (J45.40 R135.1)
GPS2_PIN14: 05-GPS_IMU_SENSORS (J13.14), 07-FPGA (J35.78), 10-M2_GPS (J45.42 R136.1)
GPS2_PIN15: 05-GPS_IMU_SENSORS (J13.15), 07-FPGA (J35.65), 10-M2_GPS (J45.44 R137.1)
GPS2_RST: 05-GPS_IMU_SENSORS (J13.4 U15.4), 07-FPGA (J36.11), 10-M2_GPS (J45.50 J45.67)
GPS2_RX: 09-USBUart_PPSMUX_UARTMUX (R103.2 U22.7), 11-M2_RCB_MUX (R146.2 R149.2 R156.2)
GPS2_RX_FPGA: 07-FPGA (J36.2), 09-USBUart_PPSMUX_UARTMUX (R93.1 R103.1)
GPS2_TP1: 07-FPGA (J36.5), 11-M2_RCB_MUX (R145.2 R151.2 R158.2)
GPS2_TP2: 07-FPGA (J36.7), 11-M2_RCB_MUX (R143.2 R153.2 R160.2)
GPS2_TX: 09-USBUart_PPSMUX_UARTMUX (R102.2 U22.11), 11-M2_RCB_MUX (R142.2 R148.2 R154.2)
GPS2_TX_FPGA: 07-FPGA (J36.1), 09-USBUart_PPSMUX_UARTMUX (R91.1 R102.1)
M2_GPS1_PIN11: 10-M2_GPS (J44.20), 11-M2_RCB_MUX (R172.2 U31.2)
M2_GPS1_PIN12: 10-M2_GPS (J44.22), 11-M2_RCB_MUX (R174.2 U31.4)
M2_GPS1_RX: 10-M2_GPS (J44.62), 11-M2_RCB_MUX (R163.1 U29.3)
M2_GPS1_TP1: 10-M2_GPS (R130.2 R138.2), 11-M2_RCB_MUX (R164.1 U29.7)
M2_GPS1_TP2: 10-M2_GPS (J44.48), 11-M2_RCB_MUX (R165.1 U29.11)
M2_GPS1_TX: 10-M2_GPS (J44.64), 11-M2_RCB_MUX (R162.1 U29.15)
M2_GPS2_PIN11: 10-M2_GPS (J45.20), 11-M2_RCB_MUX (R167.2 U30.2)
M2_GPS2_PIN12: 10-M2_GPS (J45.22), 11-M2_RCB_MUX (R169.2 U30.4)
M2_GPS2_RX: 10-M2_GPS (J45.62), 11-M2_RCB_MUX (R156.1 U28.3)
M2_GPS2_TP1: 10-M2_GPS (R131.2 R139.2), 11-M2_RCB_MUX (R158.1 U28.7)
M2_GPS2_TP2: 10-M2_GPS (J45.48), 11-M2_RCB_MUX (R160.1 U28.11)
M2_GPS2_TX: 10-M2_GPS (J45.64), 11-M2_RCB_MUX (R154.1 U28.15)
MAC_FPGA_UART_RX: 07-FPGA (J35.28), 08-DIPSwitches_I2C (R75.1 R111.1)
PCIE_CLK_N: 04-PCIe_JTAG (C45.2), 07-FPGA (J37.38)
PCIE_CLK_P: 04-PCIe_JTAG (C44.2), 07-FPGA (J37.36)
PCIE_PERST: 04-PCIe_JTAG (P2.A11 R22.1), 05-GPS_IMU_SENSORS (R54.1), 07-FPGA (J36.21), 08-DIPSwitches_I2C (R121.1)
PCIE_RX0_N: 04-PCIe_JTAG (P2.B15), 07-FPGA (J37.37)
PCIE_RX0_P: 04-PCIe_JTAG (P2.B14), 07-FPGA (J37.35)
PCIE_RX1_N: 04-PCIe_JTAG (P2.B20), 07-FPGA (J37.32)
PCIE_RX1_P: 04-PCIe_JTAG (P2.B19), 07-FPGA (J37.30)
PCIE_RX2_N: 04-PCIe_JTAG (P2.B24), 07-FPGA (J37.20)
PCIE_RX2_P: 04-PCIe_JTAG (P2.B23), 07-FPGA (J37.18)
PCIE_RX3_N: 04-PCIe_JTAG (P2.B28), 07-FPGA (J37.25)
PCIE_RX3_P: 04-PCIe_JTAG (P2.B27), 07-FPGA (J37.23)
PCIE_TX0_N: 04-PCIe_JTAG (C47.2), 07-FPGA (J37.31)
PCIE_TX0_P: 04-PCIe_JTAG (C46.2), 07-FPGA (J37.29)
PCIE_TX1_N: 04-PCIe_JTAG (C49.2), 07-FPGA (J37.26)
PCIE_TX1_P: 04-PCIe_JTAG (C48.2), 07-FPGA (J37.24)
PCIE_TX2_N: 04-PCIe_JTAG (C51.2), 07-FPGA (J37.14)
PCIE_TX2_P: 04-PCIe_JTAG (C50.2), 07-FPGA (J37.12)
PCIE_TX3_N: 04-PCIe_JTAG (C53.2), 07-FPGA (J37.19)
PCIE_TX3_P: 04-PCIe_JTAG (C52.2), 07-FPGA (J37.17)
RCB_GPS1_PIN11: 05-GPS_IMU_SENSORS (J6.11), 11-M2_RCB_MUX (R170.2 U31.10)
RCB_GPS1_PIN12: 05-GPS_IMU_SENSORS (J6.12), 11-M2_RCB_MUX (R173.2 U31.8)
RCB_GPS1_RX: 05-GPS_IMU_SENSORS (J6.5 U9.5), 11-M2_RCB_MUX (R157.1 U29.5)
RCB_GPS1_TP1: 05-GPS_IMU_SENSORS (J6.6 U9.6), 11-M2_RCB_MUX (R159.1 U29.9)
RCB_GPS1_TP2: 05-GPS_IMU_SENSORS (J6.7 U9.7), 11-M2_RCB_MUX (R161.1 U29.13)
RCB_GPS1_TX: 05-GPS_IMU_SENSORS (J6.3 U9.3), 11-M2_RCB_MUX (R155.1 U29.1)
RCB_GPS2_PIN11: 05-GPS_IMU_SENSORS (J13.11), 11-M2_RCB_MUX (R166.2 U30.10)
RCB_GPS2_PIN12: 05-GPS_IMU_SENSORS (J13.12), 11-M2_RCB_MUX (R168.2 U30.8)
RCB_GPS2_RX: 05-GPS_IMU_SENSORS (J13.5 U15.5), 11-M2_RCB_MUX (R149.1 U28.5)
RCB_GPS2_TP1: 05-GPS_IMU_SENSORS (J13.6 U15.6), 11-M2_RCB_MUX (R151.1 U28.9)
RCB_GPS2_TP2: 05-GPS_IMU_SENSORS (J13.7 U15.7), 11-M2_RCB_MUX (R153.1 U28.13)
RCB_GPS2_TX: 05-GPS_IMU_SENSORS (J13.3 U15.3), 11-M2_RCB_MUX (R148.1 U28.1)
SCL: 05-GPS_IMU_SENSORS (U7.1), 07-FPGA (J35.67), 08-DIPSwitches_I2C (R124.1 U27.12)
SDA: 05-GPS_IMU_SENSORS (U7.3), 07-FPGA (J35.61), 08-DIPSwitches_I2C (R123.1 U27.13)
SENS1_I2C_SCL: 03-POWER (R188.1 U17.4), 05-GPS_IMU_SENSORS (U13.19 U14.4)
SENS1_I2C_SDA: 03-POWER (R187.1 U17.3), 05-GPS_IMU_SENSORS (U13.20 U14.3)
SENS_I2C_SCL: 03-POWER (U2.4 U19.4), 08-DIPSwitches_I2C (R118.1 U27.5)
SENS_I2C_SDA: 03-POWER (U2.3 U19.3), 08-DIPSwitches_I2C (R117.1 U27.4)
UART1_RXD: 07-FPGA (J35.77), 09-USBUart_PPSMUX_UARTMUX (R101.2 U21.7)
UART1_TXD: 07-FPGA (J35.71), 09-USBUart_PPSMUX_UARTMUX (R100.2 U21.11)

## Assembly variants
release: not fitted P1 P5 R48
for bracket: not fitted C1 C2 C3 C4 C5 C6 C7 C8 C9 C10 C11 C12 C13 C14 C15 C16 C17 C18 C19 C20 C21 C22 C23 C24 C25 C26 C27 C28 C29 C30 C31 C32 C33 C34 C35 C36 C37 C38 C39 C40 C41 C42 C43 C44 C45 C46 C47 C48 C49 C50 C51 C52 C53 C54 C55 C56 C57 C58 C59 C60 C61 C62 C63 C64 C65 C66 C67 C68 C69 C70 C71 C72 C73 C74 C75 C76 C77 C78 C79 C80 C81 C82 C83 C84 C85 C86 C87 C88 C89 C90 C91 C92 C93 C94 C95 C96 C97 C98 C99 C100 C101 C102 C103 C104 C105 C106 C107 C108 C109 C110 C111 C112 C113 C114 C115 CR1 D1 D2 D3 D4 D5 D6 D7 D8 D9 D10 D11 D12 D19 D20 D21 D22 D23 D24 F1 FB1 J5 J6 J7 J8 J9 J10 J11 J12 J13 J14 J15 J16 J17 J18 J19 J20 J21 J22 J23 J24 J25 J26 J27 J28 J29 J30 J31 J32 J33 J34 J35 J36 J37 J38 J39 J40 J41 J42 J43 J44 J45 P1 P2 P4 P5 R1 R2 R3 R4 R5 R6 R7 R8 R9 R10 R11 R12 R13 R14 R15 R16 R17 R18 R19 R20 R21 R22 R23 R24 R25 R26 R27 R28 R29 R30 R31 R32 R33 R34 R35 R36 R37 R38 R39 R40 R41 R42 R43 R44 R45 R46 R47 R48 R49 R50 R51 R52 R53 R54 R55 R56 R57 R58 R59 R60 R61 R62 R63 R64 R65 R66 R67 R68 R69 R70 R71 R72 R73 R74 R75 R76 R77 R78 R79 R80 R81 R82 R83 R84 R85 R86 R87 R88 R89 R90 R91 R92 R93 R94 R95 R96 R97 R98 R99 R100 R101 R102 R103 R104 R105 R106 R107 R108 R109 R110 R111 R112 R113 R114 R115 R116 R117 R118 R119 R120 R121 R122 R123 R124 R125 R126 R127 R128 R129 R130 R131 R132 R133 R134 R135 R136 R137 R138 R139 R140 R141 R142 R143 R144 R145 R146 R147 R148 R149 R150 R151 R152 R153 R154 R155 R156 R157 R158 R159 R160 R161 R162 R163 R164 R165 R166 R167 R168 R169 R170 R171 R172 R173 R174 R175 R176 R177 R178 R179 R180 R181 R182 R183 R184 R185 R186 R187 R188 SKT1 SKT2 SKT3 SKT4 SKT5 SKT6 SKT7 SKT8 SKT9 SKT10 SW1 U1 U2 U3 U4 U5 U6 U7 U8 U9 U10 U11 U12 U13 U14 U15 U16 U17 U18 U19 U20 U21 U22 U23 U24 U25 U26 U27 U28 U29 U30 U31 U32 U33 U34 Y1